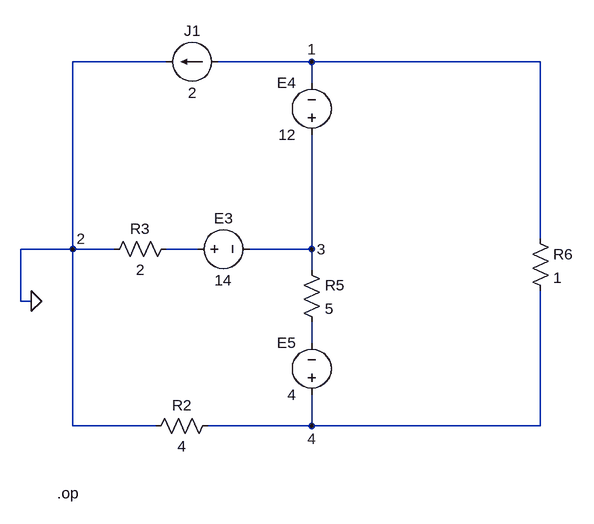
[diagram p0: schematic final_circuit.asc]
final_circuit.asc, the LTspice schematic file:
Version 4
SHEET 1 880 680
WIRE -176 -96 -320 -96
WIRE 48 -96 -96 -96
WIRE 400 -96 48 -96
WIRE 48 -64 48 -96
WIRE 400 176 400 -96
WIRE -320 192 -320 -96
WIRE -320 192 -400 192
WIRE -256 192 -320 192
WIRE -128 192 -176 192
WIRE 48 192 48 16
WIRE 48 192 -48 192
WIRE 48 224 48 192
WIRE -400 272 -400 192
WIRE -384 272 -400 272
WIRE 48 336 48 304
WIRE -320 464 -320 192
WIRE -192 464 -320 464
WIRE 48 464 48 416
WIRE 48 464 -112 464
WIRE 400 464 400 256
WIRE 400 464 48 464
FLAG 48 -96 1
FLAG -320 192 2
FLAG 48 192 3
FLAG 48 464 4
FLAG -384 272 0
SYMBOL res 32 208 R0
SYMATTR InstName R5
SYMATTR Value 5
SYMBOL res -160 176 R90
WINDOW 0 0 56 VBottom 2
WINDOW 3 32 56 VTop 2
SYMATTR InstName R3
SYMATTR Value 2
SYMBOL res -208 480 R270
WINDOW 0 32 56 VTop 2
WINDOW 3 0 56 VBottom 2
SYMATTR InstName R2
SYMATTR Value 4
SYMBOL current -96 -96 R90
WINDOW 0 -32 40 VBottom 2
WINDOW 3 32 40 VTop 2
WINDOW 123 0 0 Left 0
WINDOW 39 0 0 Left 0
SYMATTR InstName J1
SYMATTR Value 2
SYMBOL voltage -144 192 R270
WINDOW 0 32 56 VTop 2
WINDOW 3 -32 56 VBottom 2
SYMATTR InstName E3
SYMATTR Value 14
SYMBOL voltage 48 432 R180
WINDOW 0 24 96 Left 2
WINDOW 3 24 16 Left 2
SYMATTR InstName E5
SYMATTR Value 4
SYMBOL voltage 48 32 R180
WINDOW 0 24 96 Left 2
WINDOW 3 24 16 Left 2
SYMATTR InstName E4
SYMATTR Value 12
SYMBOL res 384 160 R0
SYMATTR InstName R6
SYMATTR Value 1
TEXT -344 568 Left 2 !.op

The netlist it stands for:
* final_circuit.asc
R5 3 N002 5
R3 N001 0 2
R2 0 4 4
I§J1 1 0 2
V§E3 N001 3 14
V§E5 4 N002 4
V§E4 3 1 12
R6 1 4 1
.op
.backanno
.end